# EAGLE schematic FT231X Module (EAGLE 8.6.0)
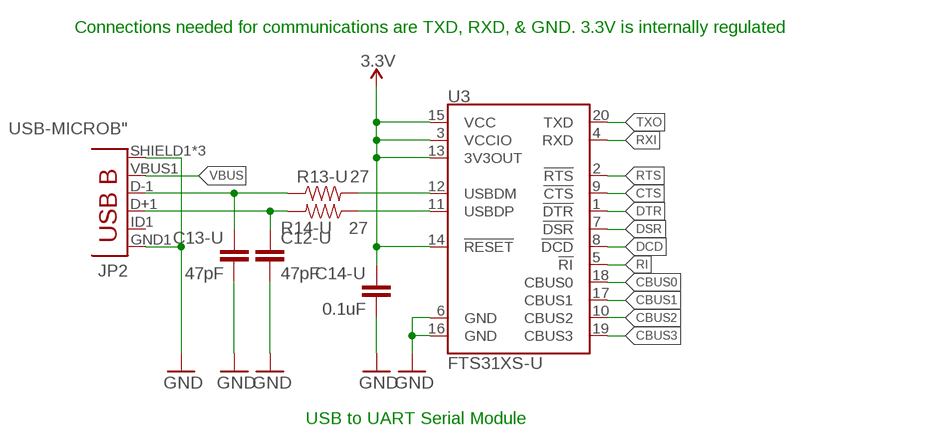
[diagram p0: schematic, sheet 1]

## Parts
C12-U  47pF  47PF-50V-5%(0603)  [0603-CAP]
C13-U  47pF  47PF-50V-5%(0603)  [0603-CAP]
C14-U  0.1uF  0.1UF-25V(+80/-20%)(0603)  [0603-CAP]
JP2  USB-MICROB"  [USB-B-MICRO-SMD_V03]
R13-U  27  27OHM1/10W1%(0603)0603-RES  [0603-RES]
R14-U  27  27OHM1/10W1%(0603)0603-RES  [0603-RES]
U3  FTS31XS-U  FT231XS  [SSOP20_L]

## Nets
3.3V [power]: C14-U.1 U3.3(VCCIO) U3.13(3V3OUT) U3.14(!RESET) U3.15(VCC)
CBUS0: U3.18(CBUS0)
CBUS3: U3.19(CBUS3)
CTS: U3.9(!CTS)
DCD: U3.8(!DCD)
DSR: U3.7(!DSR)
DTR: U3.1(!DTR)
GND: C12-U.2 C13-U.2 C14-U.2 JP2.GND1(GND) JP2.SHIELD1(SHIELD) JP2.SHIELD2(SHIELD) JP2.SHIELD3(SHIELD) U3.6(GND) U3.16(GND)
N$1: R13-U.2 U3.12(USBDM)
N$11: R14-U.1 U3.11(USBDP)
N$12: C12-U.1 JP2.D+1(D+) R14-U.2
N$21: C13-U.1 JP2.D-1(D-) R13-U.1
N$22: U3.17(CBUS1)
N$23: U3.10(CBUS2)
RI: U3.5(!RI)
RTS: U3.2(!RTS)
RXI: U3.4(RXD)
TXO: U3.20(TXD)
VBUS: JP2.VBUS1(VBUS)
Unconnected: JP2.ID1(USBID)

## Notes on the sheet
- Connections needed for communications are TXD, RXD, & GND. 3.3V is internally regulated
- USB to UART Serial Module

## Library data of the parts
C12-U C13-U = SparkFun-Capacitors:47PF-50V-5%(0603): CAP-08913; PROD_ID: CAP-08913
C14-U = SparkFun-Capacitors:0.1UF-25V(+80/-20%)(0603): CAP-00810 Ceramic Standard decoupling cap; PROD_ID: CAP-00810
JP2 = SparkFun-Connectors:USB-MICROB; PROD_ID: CONN-11752
R13-U R14-U = SparkFun-Resistors:27OHM1/10W1%(0603): RES-09334; PROD_ID: RES-09334
U3 = SparkFun-DigitalIC:FT231X: FTDI FT231X Full Speed USB to Full-handshake UART This USB2.0 Full Speed IC offers a compact bridge to full handshake UART interfaces. The device is a UART, capable of operating up to 3MBaud, with low power consumption (8mA). The FT231X includes the complete FT-X series feature set and enables USB to be added into a system design quickly and easily over a UART interface.; PROD_ID: IC-11524

## Net classes
0 default: width 0.203 mm
1 power: width 0.254 mm